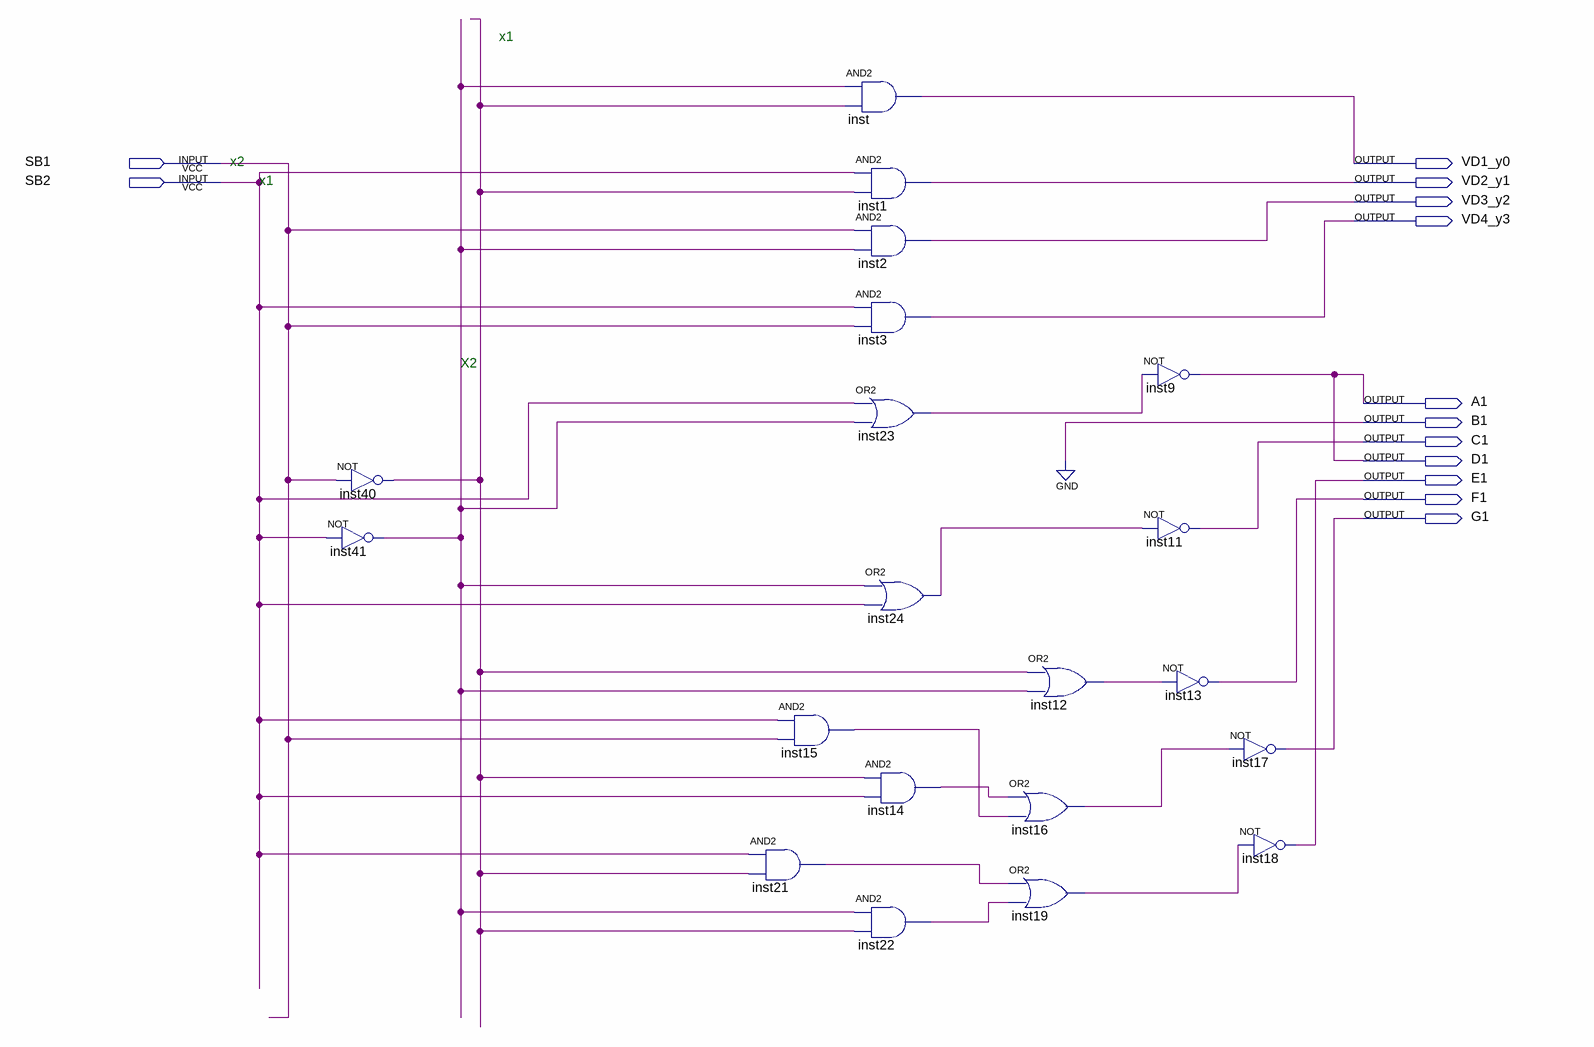
[diagram p0: schematic sheet]
// Quartus schematic Mark7.bdf as structural Verilog: 20 symbols, 13 pins
module Mark7 (
  input  SB1,
  input  SB2,
  output VD1_y0,
  output VD2_y1,
  output VD3_y2,
  output VD4_y3,
  output A1,
  output B1,
  output C1,
  output D1,
  output E1,
  output F1,
  output G1
);

  wire inst12_out, inst14_out, inst15_out, inst16_out, inst19_out, inst21_out, inst22_out, inst23_out,
       inst24_out, inst40_out, inst41_out;

  not inst40 (inst40_out, SB1);
  not inst41 (inst41_out, SB2);
  and inst15 (inst15_out, SB2, SB1);
  and inst21 (inst21_out, SB2, inst40_out);
  and inst (VD1_y0, inst41_out, inst40_out);
  and inst1 (VD2_y1, SB2, inst40_out);
  and inst2 (VD3_y2, SB1, inst41_out);
  and inst3 (VD4_y3, SB2, SB1);
  or inst23 (inst23_out, SB2, inst41_out);
  or inst24 (inst24_out, inst41_out, SB2);
  and inst14 (inst14_out, inst40_out, SB2);
  and inst22 (inst22_out, inst41_out, inst40_out);
  or inst12 (inst12_out, inst40_out, inst41_out);
  or inst16 (inst16_out, inst14_out, inst15_out);
  or inst19 (inst19_out, inst21_out, inst22_out);
  not inst9 (A1, inst23_out);
  not inst11 (C1, inst24_out);
  not inst13 (F1, inst12_out);
  not inst17 (G1, inst16_out);
  not inst18 (E1, inst19_out);

  assign B1 = 1'b0;
  assign D1 = A1;

  // Notes on the sheet:
  //   x1
  //   x2
  //   x1
  //   X2
endmodule
